# Altium schematic sheet BKRES_IOT_BOARD.SchDoc
size A; SheetNumber: 1; SheetTotal: 11
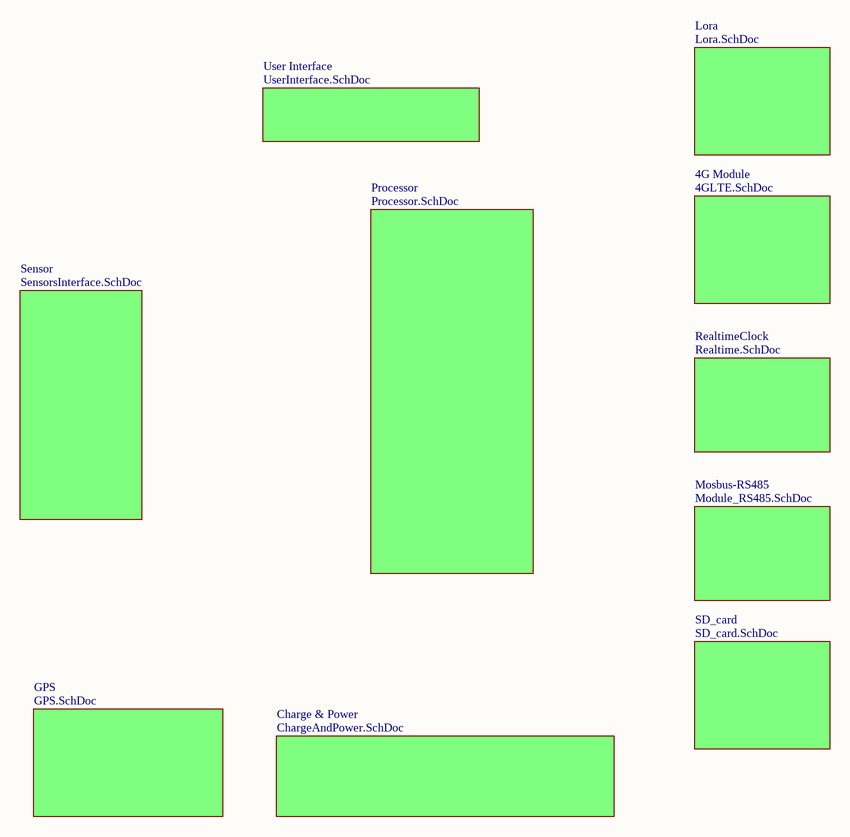
[diagram p0: BKRES_IOT_BOARD.SchDoc]

## Sub-sheets
4G Module = 4GLTE.SchDoc: no entries
Charge & Power = ChargeAndPower.SchDoc: no entries
GPS = GPS.SchDoc: no entries
Lora = Lora.SchDoc: no entries
Mosbus-RS485 = Module_RS485.SchDoc: no entries
Processor = Processor.SchDoc: no entries
RealtimeClock = Realtime.SchDoc: no entries
SD_card = SD_card.SchDoc: no entries
Sensor = SensorsInterface.SchDoc: no entries
User Interface = UserInterface.SchDoc: no entries